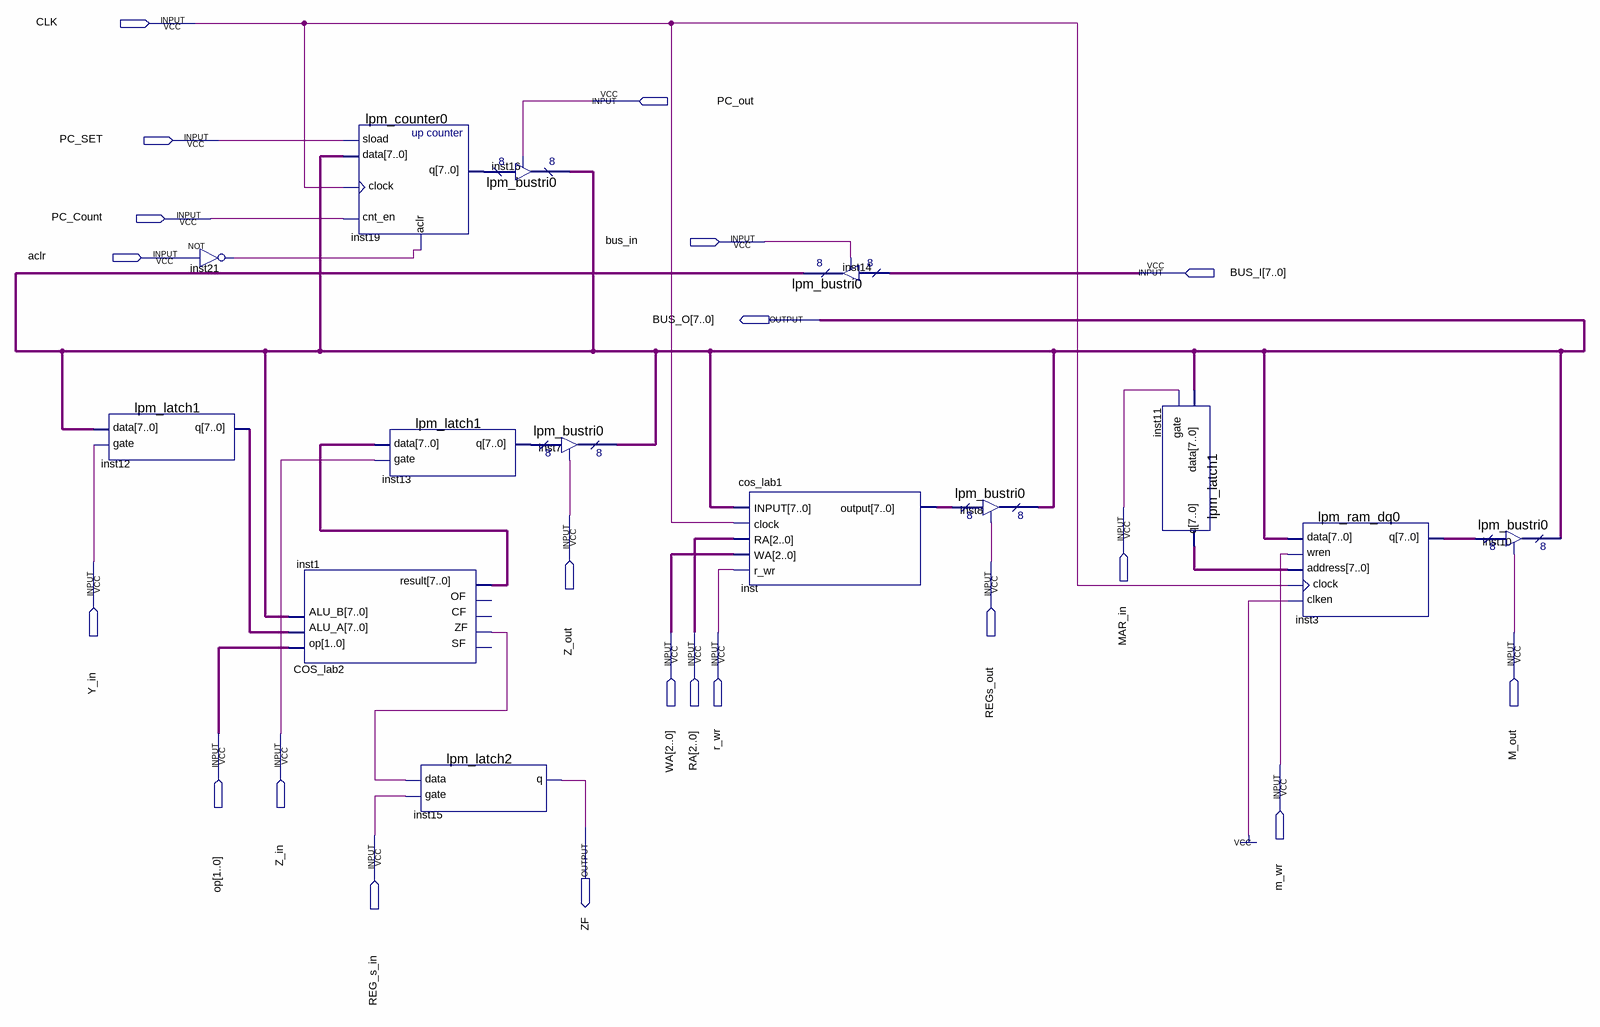
[diagram p0: schematic sheet]
// Quartus schematic COS_Lab4.bdf as structural Verilog: 14 symbols, 21 pins
module COS_Lab4 (
  input  CLK,
  input  PC_out,
  input  PC_SET,
  input  PC_Count,
  input  bus_in,
  input  aclr,
  input  [7:0] BUS_I,
  input  MAR_in,
  input  Z_out,
  input  Y_in,
  input  REGs_out,
  input  [2:0] WA,
  input  [2:0] RA,
  input  r_wr,
  input  M_out,
  input  [1:0] op,
  input  Z_in,
  input  m_wr,
  input  REG_s_in,
  output [7:0] BUS_O,
  output ZF
);

  wire inst1_zf, inst21_out;
  wire [7:0] inst1_result, inst3_q, inst11_q, inst12_q, inst13_q, inst19_q, inst_output;

  lpm_latch1 inst12 (.data(BUS_O), .gate(Y_in), .q(inst12_q));
  not inst21 (inst21_out, aclr);
  COS_lab2 inst1 (.op(op), .ALU_A(inst12_q), .ALU_B(BUS_O), .ZF(inst1_zf), .result(inst1_result));  // open: SF, CF, OF
  lpm_counter0 inst19 (.sload(PC_SET), .data(BUS_O), .clock(CLK), .cnt_en(PC_Count), .aclr(inst21_out), .q(inst19_q));
  lpm_latch1 inst13 (.data(inst1_result), .gate(Z_in), .q(inst13_q));
  lpm_latch2 inst15 (.data(inst1_zf), .gate(REG_s_in), .q(ZF));
  lpm_bustri0 inst16 (.enabledt(PC_out), .data(inst19_q), .tridata(BUS_O));
  lpm_bustri0 inst7 (.enabledt(Z_out), .data(inst13_q), .tridata(BUS_O));
  cos_lab1 inst (.INPUT(BUS_O), .clock(CLK), .RA(RA), .WA(WA), .r_wr(r_wr), .\output (inst_output));
  lpm_bustri0 inst14 (.enabledt(bus_in), .data(BUS_I), .tridata(BUS_O));
  lpm_bustri0 inst8 (.enabledt(REGs_out), .data(inst_output), .tridata(BUS_O));
  lpm_latch1 inst11 (.data(BUS_O), .gate(MAR_in), .q(inst11_q));
  lpm_ram_dq0 inst3 (.data(BUS_O), .wren(m_wr), .address(inst11_q), .clock(CLK), .clken(1'b1), .q(inst3_q));
  lpm_bustri0 inst10 (.enabledt(M_out), .data(inst3_q), .tridata(BUS_O));
endmodule
